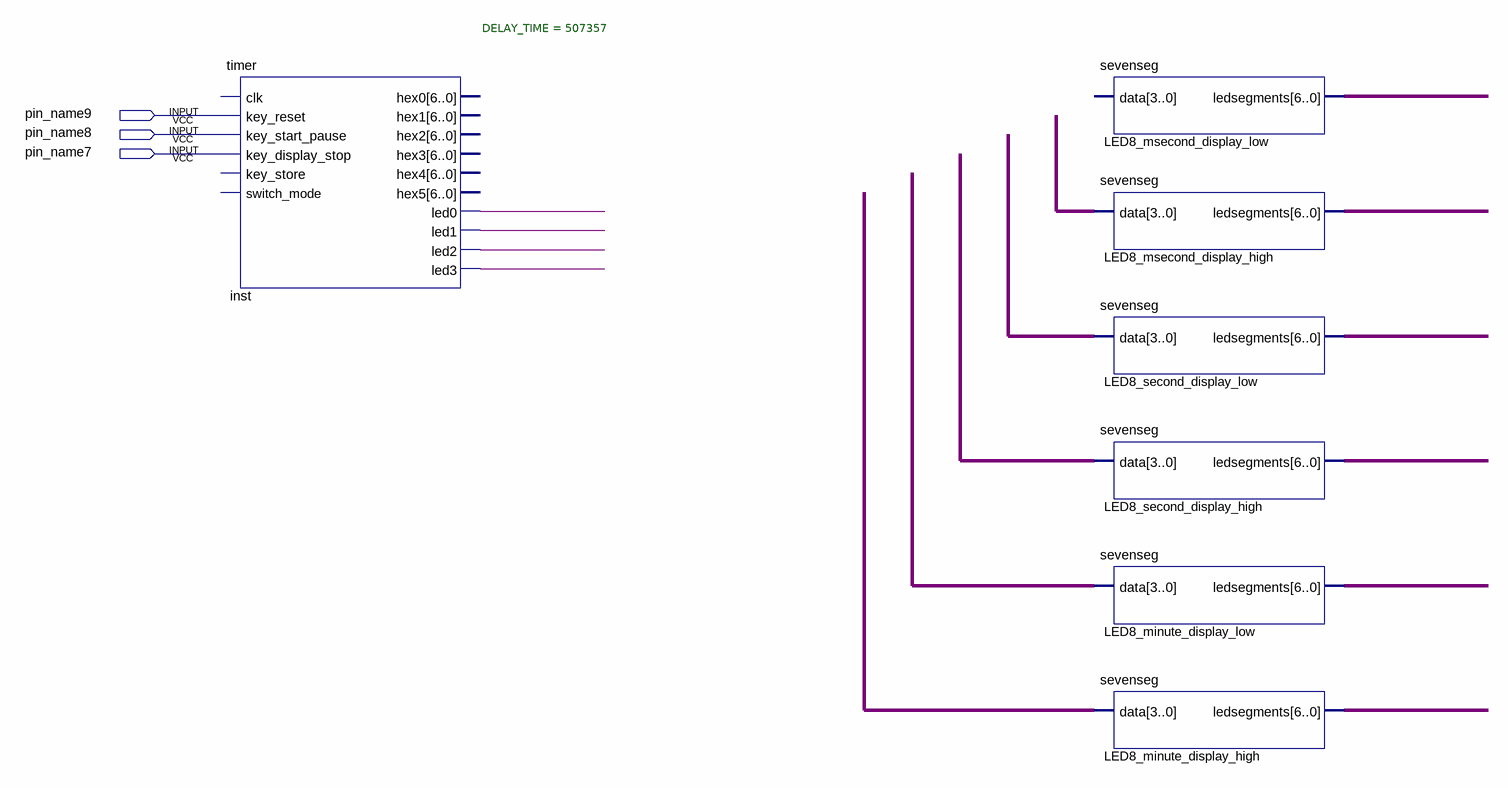
[diagram p0: schematic sheet]
// Quartus schematic test.bdf as structural Verilog: 7 symbols, 3 pins
module test (
  input  pin_name9,
  input  pin_name8,
  input  pin_name7
);

  wire inst_led0, inst_led1, inst_led2, inst_led3;
  wire [3:0] undriven, undriven_2, undriven_3, undriven_4, undriven_5;
  wire [6:0] LED8_minute_display_high_ledsegments, LED8_minute_display_low_ledsegments,
       LED8_msecond_display_high_ledsegments, LED8_msecond_display_low_ledsegments,
       LED8_second_display_high_ledsegments, LED8_second_display_low_ledsegments;

  timer #(.DELAY_TIME(507357)) inst (
    .key_reset(pin_name9), .key_start_pause(pin_name8), .key_display_stop(pin_name7), .led0(inst_led0),
    .led1(inst_led1), .led2(inst_led2), .led3(inst_led3));  // open: clk, key_store, switch_mode, hex0, hex1, hex2, hex3, hex4, hex5
  sevenseg LED8_msecond_display_low (.ledsegments(LED8_msecond_display_low_ledsegments));  // open: data
  sevenseg LED8_msecond_display_high (.data(undriven), .ledsegments(LED8_msecond_display_high_ledsegments));
  sevenseg LED8_second_display_low (.data(undriven_2), .ledsegments(LED8_second_display_low_ledsegments));
  sevenseg LED8_second_display_high (.data(undriven_3), .ledsegments(LED8_second_display_high_ledsegments));
  sevenseg LED8_minute_display_low (.data(undriven_4), .ledsegments(LED8_minute_display_low_ledsegments));
  sevenseg LED8_minute_display_high (.data(undriven_5), .ledsegments(LED8_minute_display_high_ledsegments));
endmodule
